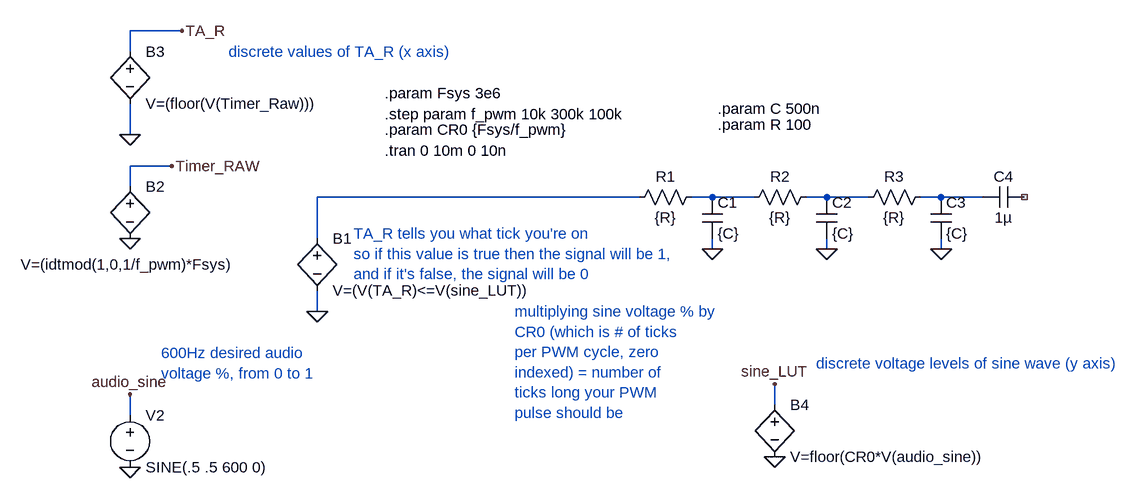
[diagram p0: schematic Draft2.asc]
Draft2.asc, the LTspice schematic file:
Version 4
SHEET 1 1624 680
WIRE -720 -320 -800 -320
WIRE -800 -288 -800 -320
WIRE -800 -160 -800 -208
WIRE -736 -112 -800 -112
WIRE -800 -80 -800 -112
WIRE -16 -64 -512 -64
WIRE 96 -64 64 -64
WIRE 160 -64 96 -64
WIRE 272 -64 240 -64
WIRE 336 -64 272 -64
WIRE 448 -64 416 -64
WIRE 512 -64 448 -64
WIRE -512 0 -512 -64
WIRE 96 16 96 0
WIRE 272 16 272 0
WIRE 448 16 448 0
WIRE -512 112 -512 80
WIRE 192 256 192 224
WIRE -800 272 -800 240
FLAG -800 352 0
FLAG -800 240 audio_sine
FLAG -512 112 0
FLAG 96 16 0
FLAG 272 16 0
FLAG 448 16 0
FLAG -800 0 0
FLAG -736 -112 Timer_RAW
FLAG -720 -320 TA_R
FLAG -800 -160 0
FLAG 192 336 0
FLAG 192 224 sine_LUT
SYMBOL voltage -800 256 R0
WINDOW 123 0 0 Left 0
WINDOW 39 0 0 Left 0
SYMATTR InstName V2
SYMATTR Value SINE(.5 .5 600 0)
SYMBOL bv -512 -16 R0
SYMATTR InstName B1
SYMATTR Value V=(V(TA_R)<=V(sine_LUT))
SYMBOL res 80 -80 R90
WINDOW 0 0 56 VBottom 2
WINDOW 3 32 56 VTop 2
SYMATTR InstName R1
SYMATTR Value {R}
SYMBOL cap 80 -64 R0
SYMATTR InstName C1
SYMATTR Value {C}
SYMBOL res 256 -80 R90
WINDOW 0 0 56 VBottom 2
WINDOW 3 32 56 VTop 2
SYMATTR InstName R2
SYMATTR Value {R}
SYMBOL cap 256 -64 R0
SYMATTR InstName C2
SYMATTR Value {C}
SYMBOL res 432 -80 R90
WINDOW 0 0 56 VBottom 2
WINDOW 3 32 56 VTop 2
SYMATTR InstName R3
SYMATTR Value {R}
SYMBOL cap 432 -64 R0
SYMATTR InstName C3
SYMATTR Value {C}
SYMBOL bv -800 -96 R0
WINDOW 3 -168 136 Left 2
SYMATTR Value V=(idtmod(1,0,1/f_pwm)*Fsys)
SYMATTR InstName B2
SYMBOL bv -800 -304 R0
SYMATTR InstName B3
SYMATTR Value V=(floor(V(Timer_Raw)))
SYMBOL bv 192 240 R0
SYMATTR InstName B4
SYMATTR Value V=floor(CR0*V(audio_sine))
SYMBOL cap 576 -80 R90
WINDOW 0 0 32 VBottom 2
WINDOW 3 32 32 VTop 2
SYMATTR InstName C4
SYMATTR Value 1µ
TEXT -408 -192 Left 2 !.step param f_pwm 10k 300k 100k
TEXT -408 -136 Left 2 !.tran 0 10m 0 10n
TEXT 104 -200 Left 2 !.param C 500n
TEXT 104 -176 Left 2 !.param R 100
TEXT -408 -224 Left 2 !.param Fsys 3e6
TEXT -408 -168 Left 2 !.param CR0 {Fsys/f_pwm}
TEXT -752 176 Left 2 ;600Hz desired audio \nvoltage %, from 0 to 1
TEXT -208 112 Left 2 ;multiplying sine voltage % by \nCR0 (which is # of ticks \nper PWM cycle, zero \nindexed) = number of \nticks long your PWM \npulse should be
TEXT -456 -8 Left 2 ;TA_R tells you what tick you're on \nso if this value is true then the signal will be 1, \nand if it's false, the signal will be 0
TEXT -648 -288 Left 2 ;discrete values of TA_R (x axis)
TEXT 256 192 Left 2 ;discrete voltage levels of sine wave (y axis)

The netlist it stands for:
* Draft2.asc
V2 audio_sine 0 SINE(.5 .5 600 0)
B1 N001 0 V=(V(TA_R)<=V(sine_LUT))
R1 N002 N001 {R}
C1 N002 0 {C}
R2 N003 N002 {R}
C2 N003 0 {C}
R3 N004 N003 {R}
C3 N004 0 {C}
B2 Timer_RAW 0 V=(idtmod(1,0,1/f_pwm)*Fsys)
B3 TA_R 0 V=(floor(V(Timer_Raw)))
B4 sine_LUT 0 V=floor(CR0*V(audio_sine))
C4 NC_01 N004 1µ
.step param f_pwm 10k 300k 100k
.tran 0 10m 0 10n
.param C 500n
.param R 100
.param Fsys 3e6
.param CR0 {Fsys/f_pwm}
* 600Hz desired audio
* voltage %, from 0 to 1
* multiplying sine voltage % by
* CR0 (which is # of ticks
* per PWM cycle, zero
* indexed) = number of
* ticks long your PWM
* pulse should be
* TA_R tells you what tick you're on
* so if this value is true then the signal will be 1,
* and if it's false, the signal will be 0
* discrete values of TA_R (x axis)
* discrete voltage levels of sine wave (y axis)
.backanno
.end